# EAGLE design candle-001 (EAGLE 9.6.2)
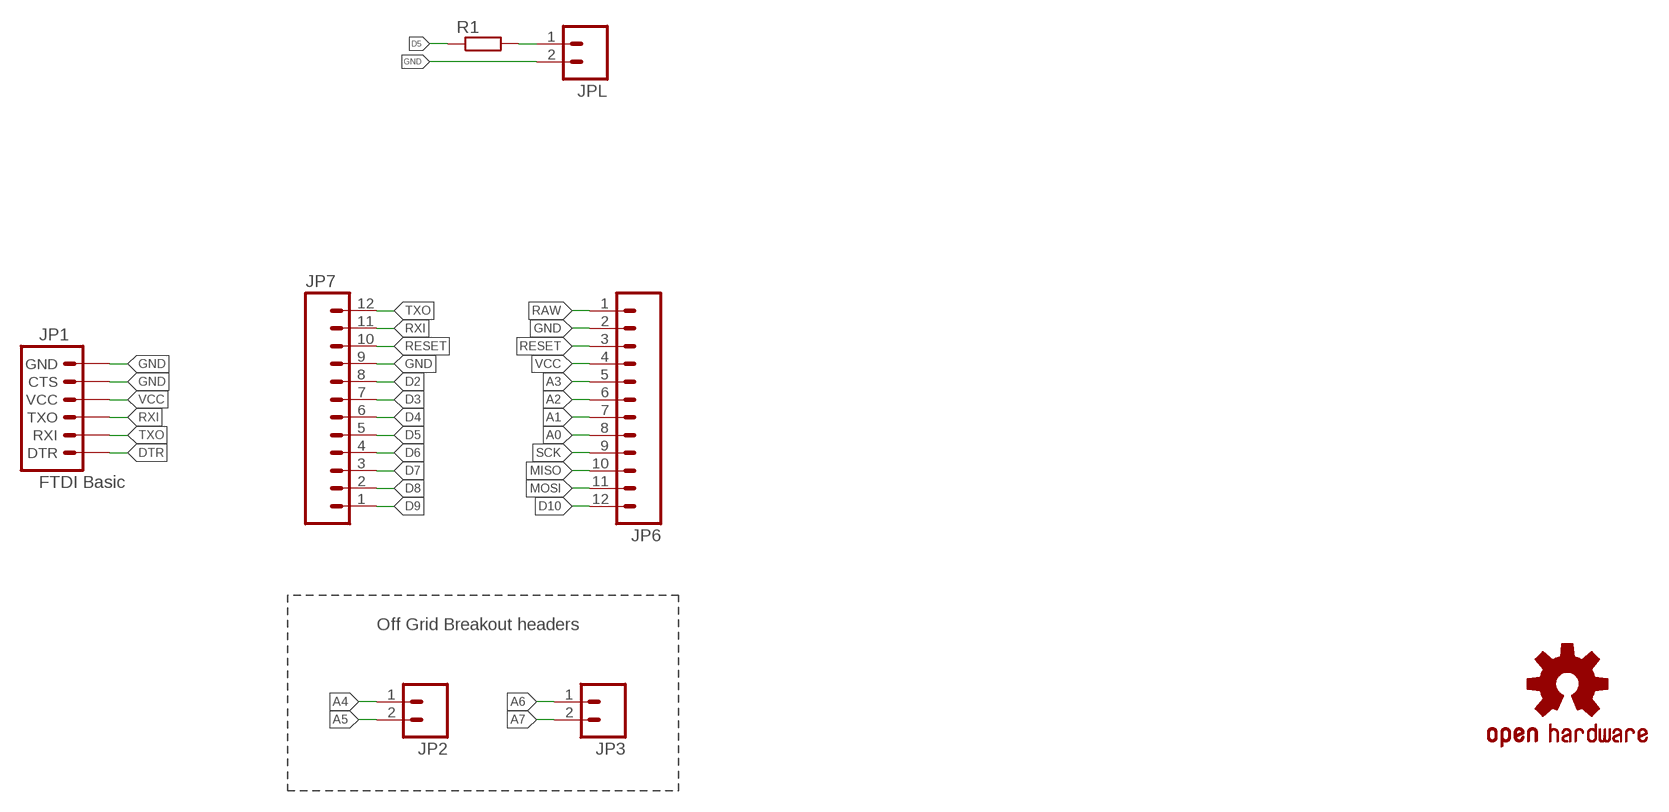
[diagram p0: schematic, sheet 1]

## Parts
JP1  FTDI Basic  ARDUINO_SERIAL_PROGRAMPTH  [1X06]
JP2  M02PTH  [1X02]
JP3  M02PTH  [1X02]
JP6  M12PTH  [1X12]
JP7  M12PTH  [1X12]
JPL  M02PTH  [1X02]
R1  R-EU_0204/5  [0204/5]
U$3  OSHW-LOGOS  [OSHW-LOGO-S]

## Nets
A0: JP6.8
A1: JP6.7
A2: JP6.6
A3: JP6.5
A4: JP2.1
A5: JP2.2
A6: JP3.1
A7: JP3.2
D2: JP7.8
D3: JP7.7
D4: JP7.6
D5: JP7.5 R1.1
D6: JP7.4
D7: JP7.3
D8: JP7.2
D9: JP7.1
D10: JP6.12
DTR: JP1.1(DTR)
GND [vcc]: JP1.5(CTS) JP1.6(GND) JP6.2 JP7.9 JPL.2
MISO: JP6.10
MOSI: JP6.11
N$1: JPL.1 R1.2
RAW [vcc]: JP6.1
RESET: JP6.3 JP7.10
RXI: JP1.3(TXO) JP7.11
SCK: JP6.9
TXO: JP1.2(RXI) JP7.12
VCC: JP1.4(VCC) JP6.4

## Notes on the sheet
- Off Grid Breakout headers

## Library data of the parts
JP1 = SparkFun:ARDUINO_SERIAL_PROGRAM
JP2 JP3 JPL = SparkFun:M02: Header 2 Standard 2-pin 0.1" header. Use with straight break away headers (SKU : PRT-00116), right angle break away headers (PRT-00553), swiss pins (PRT-00743), machine pins (PRT-00117), and female headers (PRT-00115). Molex polarized connector foot print use with SKU : PRT-08233 with associated crimp pins and housings.
JP6 JP7 = SparkFun:M12: Header 12 Standard 12-pin 0.1" header. Use with straight break away headers (SKU : PRT-00116), right angle break away headers (PRT-00553), swiss pins (PRT-00743), machine pins (PRT-00117), and female headers (PRT-00115).
R1 = resistor:R-EU_: RESISTOR, European symbol
U$3 = SparkFun:OSHW-LOGO: Open Source Hardware Logo This logo indicates the piece of hardware it is found on incorporates a OSHW license and/or adheres to the definition of open source hardware found here: http://freedomdefined.org/OSHW

## Net classes
0 default: width 0.203 mm
1 vcc: width 0.254 mm

## Board
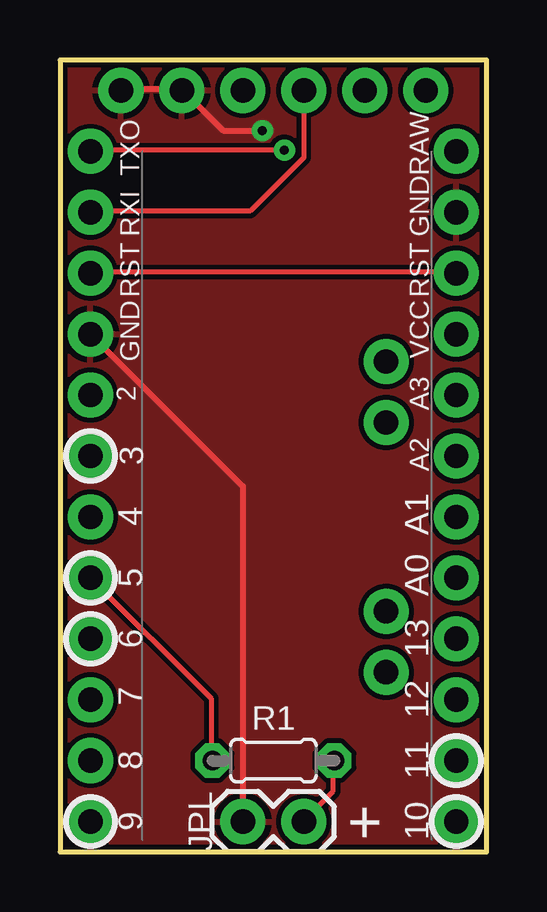
[diagram p1: board, top side]
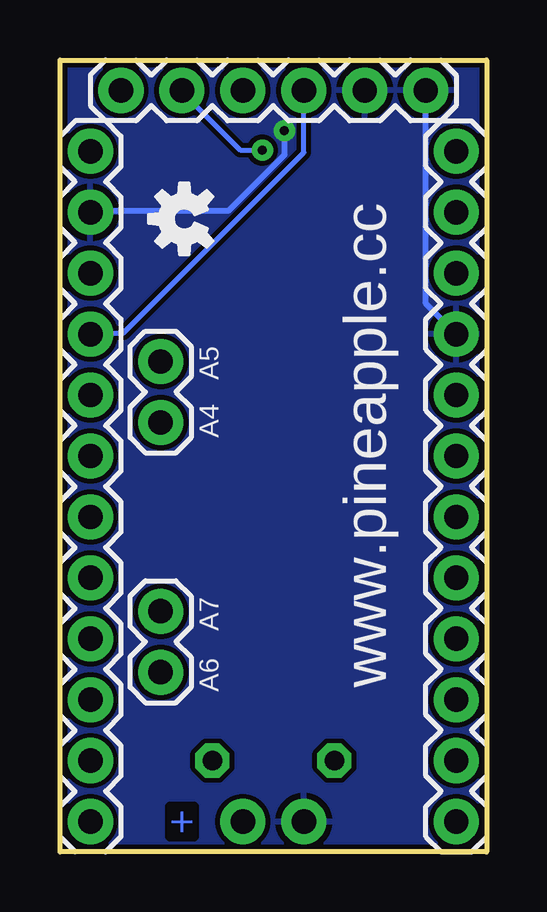
[diagram p2: board, bottom side, seen from below]

Size 17.78 x 33.02 mm. Coordinates in mm from the lower left corner, seen from the top.
Outline: 0,33.02 0,0 17.78,0 17.78,33.02 0,33.02
Copper layers (1*16): Top 0.035mm / dielectric 1.5mm / Bottom 0.035mm
Design rules "SparkFun-2-layer *": minimum track width 7mil, minimum drill 15mil, track to track 8mil, track to pad 8mil, pad to pad 8mil, via to via 8mil, smd to smd 8mil, copper to edge 8mil, drill to drill 8mil, minimum pad ring 12mil, minimum via ring 10mil, stop-mask expansion 4mil, vias tented up to drill 20mil, thermal gap 10mil

### Footprints (pad centres in the part's own frame; a part is rotated, then mirrored left to right if it is on the bottom)
1X06 = drill 1.016 pad 1.88: 1 0,0; 2 2.54,0; 3 5.08,0; 4 7.62,0; 5 10.16,0; 6 12.7,0
1X02 = drill 1.016 pad 1.88: 1 0,0; 2 2.54,0
1X12 = drill 1.016 pad 1.88: 1 0,0; 2 2.54,0; 3 5.08,0; 4 7.62,0; 5 10.16,0; 6 12.7,0; 7 15.24,0; 8 17.78,0; 9 20.32,0; 10 22.86,0; 11 25.4,0; 12 27.94,0
0204/5 = drill 0.813 octagon: 1 -2.54,0; 2 2.54,0

### Placement (x,y rotation side)
JP1  15.24,31.75 0 bottom
JP2  13.59,17.91 90 bottom
JP3  13.59,7.49 90 bottom
JP6  16.51,29.21 270 bottom
JP7  1.27,1.27 90 bottom
JPL  10.16,1.27 180 top
R1  8.89,3.81 0 top
U$3  12.6,26.39 90 bottom

### Tracks (layer width: path | path; a pad name or v marks a point on that pad's centre or on a via)
D5
  Top 0.203: JP7.5 6.3,6.4 6.3,3.86 R1.1
GND  (via drill 0.38)
  Top 0.254: JP1.6 2.54,31.8 5.08,31.8 JP1.5 5.18,31.7 6.81,30.07 v8.43,30.07 | JPL.2 7.62,15.24 JP7.9
  Bottom 0.254: v8.43,30.07 8.43,29.06 10.77,26.72 16.46,26.72 JP6.2 | JP1.6 2.54,22.86 JP7.9
  pour Top: -1.27,-1.27 19.05,-1.27 19.05,34.29 -1.27,34.29
  pour Bottom: -2.54,-2.54 20.32,-2.54 20.32,35.56 -2.54,35.56
N$1
  Top 0.203: R1.2 11.38,3.76 11.38,2.54 10.16,1.32 JPL.1
RESET
  Top 0.203: JP7.10 1.32,24.18 16.46,24.18 JP6.3
RXI
  Top 0.203: JP1.3 10.16,28.96 7.92,26.72 1.32,26.72 JP7.11
TXO  (via drill 0.38)
  Top 0.203: v9.35,29.26 1.32,29.26 JP7.12
  Bottom 0.203: v9.35,29.26 10.26,29.26 12.7,31.7 JP1.2
VCC
  Bottom 0.203: JP1.4 7.62,29.16 15.14,21.64 16.46,21.64 JP6.4

### Text on the board
Bottom: +
tPlace: TXO | RAW | RXI | GND | RST | RST | VCC | GND | 2 | A3 | 3 | A2 | 4 | A1 | 5 | A0 | 6 | 13 | 7 | 12 | 8 | 11 | 9 | 10
bPlace: A5 | A4 | A7 | www.pineapple.cc | A6
tNames: +